# Altium schematic sheet MCED_IO.SchDoc
size A4; SheetNumber: 2; SheetTotal: 2
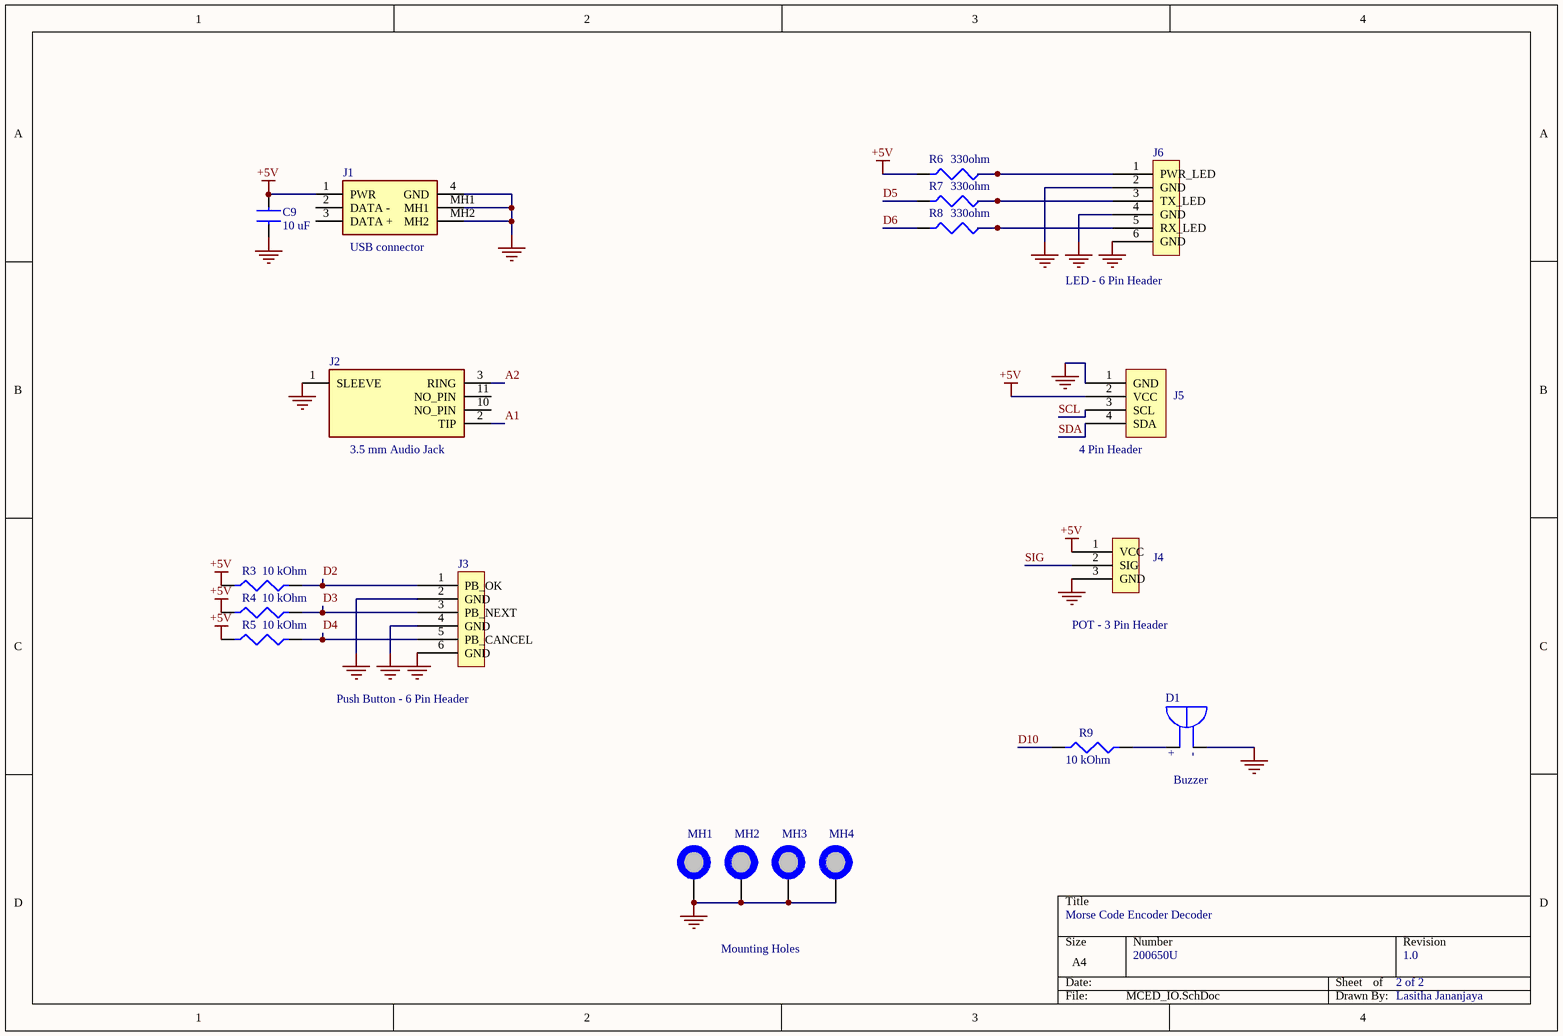
[diagram p0: MCED_IO.SchDoc]

## Parts
C9  10 uF  [C0805]
D1  Buzzer  [Buzzer]
J1  USB connector  [USB 2.0 type B 617291011BLF]
J2  3.5 mm Audio Jack  [Audio Jack SJ13523N]
J3  Push Button - 6 Pin Header  [6 PIN HEADER]
J4  POT - 3 Pin Header  [3 PIN HEADER]
J5  4 Pin Header  [4 Pin Header]
J6  LED - 6 Pin Header  [6 PIN HEADER]
MH1  MH  [Mounting Hole]  (value not drawn)  (no BOM)
MH2  MH  [Mounting Hole]  (value not drawn)  (no BOM)
MH3  MH  [Mounting Hole]  (value not drawn)  (no BOM)
MH4  MH  [Mounting Hole]  (value not drawn)  (no BOM)
R3  10 kOhm  [10K]
R4  10 kOhm  [10K]
R5  10 kOhm  [10K]
R6  330ohm  [300Ohm RESC2012X60N]
R7  330ohm  [300Ohm RESC2012X60N]
R8  330ohm  [300Ohm RESC2012X60N]
R9  10 kOhm  [10K]

## Nets
+5V: C9.2 J1.1(PWR) J4.1(VCC) J5.2(VCC) R3.2 R4.2 R5.2 R6.1
GND: C9.1 D1.N(NEG) J1.4(GND) J1.MH1 J1.MH2 J2.1(SLEEVE) J3.2(GND) J3.4(GND) J3.6(GND) J4.3(GND) J5.1(GND) J6.2(GND) J6.4(GND) J6.6(GND) MH1.1 MH2.1 MH3.1 MH4.1
A1: J2.2(TIP)
A2: J2.3(RING)
D2: J3.1(PB_OK) R3.1
D3: J3.3(PB_NEXT) R4.1
D4: J3.5(PB_CANCEL) R5.1
D5: R7.1
D6: R8.1
D10: R9.2
SCL: J5.3(SCL)
SDA: J5.4(SDA)
SIG: J4.2(SIG)
NetD1_P: D1.P(POS) R9.1
NetJ6_1: J6.1(PWR_LED) R6.2
NetJ6_3: J6.3(TX_LED) R7.2
NetJ6_5: J6.5(RX_LED) R8.2

Not connected (* = marked no-connect by the designer): J1 2(DATA_-) 3(DATA_+); J2 10(NO_PIN) 11(NO_PIN)

## Notes on the sheet
- Morse Code Encoder Decoder
- Mounting Holes
- 200650U
- 2 of 2
- 1.0
- Lasitha Jananjaya
- (in symbol KXG1201C) +; -

## Library data of the parts
C9 = CL21A106KBYQNNE: 10 uF Ceramic Capacitor, Multilayer, Ceramic, 50V, 10% +Tol, 10% -Tol, X5R, 15% TC, 10uF, Surface Mount, 0805; Manufacturer: Samsung; Supplier: Mouser; Supplier Part Number: 187-CL21A106KBYQNNE; Manufacturer Part Number: CL21A106KBYQNNE; RoHS: Yes; Category: Ceramic Capacitors; Stock: 29602; Pricing: 1=0.42, 10=0.299, 50=0.299, 100=0.197, 1000=0.124, 10000=0.1 (USD); Pins: 2; Dielectric Material: Ceramic; Capacitor Type: Ceramic; Reach SVHC Compliant: Yes; RoHS Compliant: Yes; ComponentLink1URL: https://datasheet.ciiva.com:443/pdfs/VipMasterIC/IC/SEMS/SEMS-S-A0008524728/SEMS-S-A0008519922-1.pdf?src-supplier=IHS+Markit; ComponentLink1Description: https://datasheet.ciiva.com:443/pdfs/VipMasterIC/IC/SEMS/SEMS-S-A0008524728/SEMS-S-A0008519922-1.pdf?src-supplier=IHS+Markit
D1 = KXG1201C: Buzzer - Magnetic Indicator Active Buzzer [Kingstate], Pine Type, Dimensions(mm): 12.00*9.50, Voltage:1.2~3.0, Max current consumption(mA): Max. 30, SPL(dB): Min. 80dB(Typical 85)@10cm, Frequency(KHz): 2.30.; Package: None; MF: Kingstate; Value: *; Availability: In Stock; SnapEDA_Link: https://www.snapeda.com/parts/KXG1201C/Kingstate/view-part/?ref=snap; MP: KXG1201C; Price: None; Check_prices: https://www.snapeda.com/parts/KXG1201C/Kingstate/view-part/?ref=eda
J1 = 61729-1011BLF: USB 2.0 connector, Type B, Receptacle, Through Hole, 30u GXT Contact, 4 Pins, 1.57mm PCB; Manufacturer: Amphenol ICC / FCI; Supplier: Avnet; Supplier Part Number: 61729-1011BLF; Manufacturer Part Number: 61729-1011BLF; RoHS: No; Category: Connectors; ComponentLink1URL: https://datasheet.ciiva.com/8015/697864-8015261.pdf?src-supplier=Element14; ComponentLink1Description: https://datasheet.ciiva.com/8015/697864-8015261.pdf?src-supplier=Element14
J2 = SJ1-3523N: 3.5 mm Audio Jack, Female, 3 Pole(s), Solder Terminal, Jack; Manufacturer: CUI Devices; Supplier: Mouser; Supplier Part Number: 490-SJ1-3523N; Manufacturer Part Number: SJ1-3523N; RoHS: Yes; Category: Audio / Video Connectors; Stock: 9497; Pricing: 1=1.08, 10=0.913, 50=0.913, 100=0.819, 1000=0.596, 10000=0.495 (USD); Reach SVHC Compliant: Yes
J3 J6 = 929850-01-06-RB: 6 Pin Header Board Connector; Manufacturer: 3M; Manufacturer Series: 929; Supplier: Mouser; Supplier Part Number: 517-929850-01-06-RB; Manufacturer Part Number: 929850-01-06-RB; RoHS: Yes; Category: Headers and Wire Housings; Stock: 258; Pricing: 1=2.56, 10=2.08, 50=2.08, 100=1.99, 1000=1.42, 10000=1.26 (USD); Connector Type: BOARD CONNECTOR; Reach SVHC Compliant: Yes; RoHS Compliant: Yes; ComponentLink1URL: https://datasheet.ciiva.com:443/pdfs/VipMasterIC/IC/IIIM/IIIMS03618/IIIMS03618-1.pdf?src-supplier=IHS+Markit; ComponentLink1Description: https://datasheet.ciiva.com:443/pdfs/VipMasterIC/IC/IIIM/IIIMS03618/IIIMS03618-1.pdf?src-supplier=IHS+Markit; ComponentLink2URL: https://datasheet.ciiva.com/5148/ts0815-5148223.pdf?src-supplier=Mouser; ComponentLink2Description: https://datasheet.ciiva.com/5148/ts0815-5148223.pdf?src-supplier=Mouser; ComponentLink3URL: https://datasheet.ciiva.com/756/ts0815-756418.pdf?src-supplier=Digi-Key; ComponentLink3Description: https://datasheet.ciiva.com/756/ts0815-756418.pdf?src-supplier=Digi-Key
J4 = 929850-01-03-RA: 3 Pin Header Board Connector, 3 Contact(s), 1 Row(s), Female, Straight, Solder Terminal, Socket; Manufacturer: 3M; Manufacturer Series: 929; Option: General Purpose; Filter Feature: No; Number of Rows Loaded: 1; Number of Contacts: 3; Supplier: Digi-Key; Supplier Part Number: 19-929850-01-03-RA-ND; Manufacturer Part Number: 929850-01-03-RA; RoHS: Yes; Category: Headers and Wire Housings; Stock: 1296; Pricing: 1=1.97, 10=1.719, 100=1.536, 500=1.28002, 1000=1.09716, 5000=0.97282, 10000=0.95088 (USD); Mounting Technology: Board; Contact Material: Copper Alloy; Contact Finish - Mating: GOLD (10) OVER NICKEL (100); Contact Finish - Termination: MATTE TIN OVER NICKEL (100); Connector Type: BOARD CONNECTOR; JESD-609 Code: e3; Additional Feature: 3M; Body/Shell Style: SOCKET; Contact Gender: Female; Mixed Contacts: No; Mounting Style: STRAIGHT; Termination: Solder; Terminal Pitch: 2.54mm; Flammability Rating: UL94 V-0; DIN Conformance: No; IEC Conformance: No; MIL Conformance: No; Reach SVHC Compliant: Yes; RoHS Compliant: Yes; ComponentLink1URL: https://datasheet.ciiva.com:443/pdfs/VipMasterIC/IC/IIIM/IIIMS03618/IIIMS03618-1.pdf?src-supplier=IHS+Markit; ComponentLink1Description: https://datasheet.ciiva.com:443/pdfs/VipMasterIC/IC/IIIM/IIIMS03618/IIIMS03618-1.pdf?src-supplier=IHS+Markit; ComponentLink2URL: https://datasheet.ciiva.com/746/ts0815-746343.pdf?src-supplier=Digi-Key; ComponentLink2Description: https://datasheet.ciiva.com/746/ts0815-746343.pdf?src-supplier=Digi-Key; ComponentLink3URL: https://datasheet.ciiva.com/5167/ts0815-5167287.pdf?src-supplier=Mouser; ComponentLink3Description: https://datasheet.ciiva.com/5167/ts0815-5167287.pdf?src-supplier=Mouser
J5 = M20-7820446: 4 Pin Header Board Connector, 4 Contact(s), 1 Row(s), Female, Straight, 0.1 inch Pitch, Solder Terminal, Locking, Black Insulator, Socket; Manufacturer: Harwin; Option: General Purpose; Contact Pattern: RECTANGULAR; Contact Resistance: 20mR; Contact Style: SQ PIN-SKT; Dielectric Withstanding Voltage (AC): 1kV; Durability: 300Cycles; Filter Feature: No; Insulation Resistance: 1GR; Number Of Connectors: 1; Polarization Key: POLARIZED HOUSING; Rated Current (Signal): 3A; Number of Contacts: 4; Body Breadth: 0.098inch; Body Depth: 0.335inch; Body Length: 0.4inch; Reference Standard: UL; Reliability: COMMERCIAL; Supplier: Digi-Key; Supplier Part Number: 952-1792-ND; Manufacturer Part Number: M20-7820446; RoHS: Yes; Category: Headers and Wire Housings; Stock: 3461; Pricing: 1=1.02, 10=0.859, 100=0.771, 500=0.63084, 1000=0.56075, 5000=0.49066, 10000=0.46613 (USD); Mounting Technology: Board; Contact Finish - Mating: TIN; Contact Finish - Termination: TIN; Insulation Color: Black; Insulation Material: Polyamide; Min Operating Temperature: -40°C; Max Operating Temperature: 105°C; Connector Type: BOARD CONNECTOR; JESD-609 Code: e3; Body/Shell Style: SOCKET; Contact Gender: Female; Mixed Contacts: No; Mounting Style: STRAIGHT; Number Of PCB Rows: 1; Number of Rows Loaded: 1; PCB Contact Pattern: RECTANGULAR; Termination: Solder; Mating Contact Pitch: 0.1inch; Mounting Option 1: LOCKING; Terminal Length: 0.118inch; Terminal Pitch: 2.54mm; Flammability Rating: UL94 V-0; DIN Conformance: No; IEC Conformance: No; MIL Conformance: No; Reach SVHC Compliant: Yes; RoHS Compliant: Yes; ComponentLink1URL: https://datasheet.ciiva.com:443/pdfs/VipMasterIC/IC/HRWN/HRWN-S-A0004894635/HRWN-S-A0004894635-1.pdf?src-supplier=IHS+Markit; ComponentLink1Description: https://datasheet.ciiva.com:443/pdfs/VipMasterIC/IC/HRWN/HRWN-S-A0004894635/HRWN-S-A0004894635-1.pdf?src-supplier=IHS+Markit; ComponentLink2URL: https://datasheet.ciiva.com/11747/0900766b80dc1d2b-11747084.pdf?src-supplier=Rs; ComponentLink2Description: https://datasheet.ciiva.com/11747/0900766b80dc1d2b-11747084.pdf?src-supplier=Rs; ComponentLink3URL: https://datasheet.ciiva.com/6784/m20-782-6784360.pdf?src-supplier=Digi-Key; ComponentLink3Description: https://datasheet.ciiva.com/6784/m20-782-6784360.pdf?src-supplier=Digi-Key; ComponentLink4URL: https://datasheet.ciiva.com/7639/1836950-7639727.pdf?src-supplier=Element14; ComponentLink4Description: https://datasheet.ciiva.com/7639/1836950-7639727.pdf?src-supplier=Element14; ComponentLink5URL: https://datasheet.ciiva.com/10151/m20-782-10151359.pdf?src-supplier=Avnet; ComponentLink5Description: https://datasheet.ciiva.com/10151/m20-782-10151359.pdf?src-supplier=Avnet
MH1-MH4 = Mounting Hole
R3-R5 R9 = MCU0805MD1002DP500: 10 kOhm, Fixed Resistor, Thin Film, 0.2W, 10000ohm, 150V, 0.5% +/-Tol, -25,25ppm/Cel, 0805; Manufacturer: Vishay Beyschlag; Power: 200mW; Value: 10kR; Temperature Coefficient: -2525ppm/°C; Package Height: 0.52mm; Package Length: 2mm; Package Width: 1.25mm; Reference Standard: AEC-Q200; Supplier: Mouser; Supplier Part Number: 594-MCU0805MD1002DP5; Manufacturer Part Number: MCU0805MD1002DP500; RoHS: Yes; Category: Chip SMD Resistors; Stock: 49020; Pricing: 1=0.39, 10=0.3, 50=0.3, 100=0.127, 1000=0.07, 10000=0.06 (USD); Pins: 2; Case/Package: 0805; Terminal Finish: Nickel; Min Operating Temperature: -55°C; Max Operating Temperature: 175°C; Tolerance: 0.5%; JESD-609 Code: e3; Resistor Type: FIXED RESISTOR; Construction: Chip; Package Style: SMTMeter; Packaging: Tape and Reel; Series: MCU 0805 AT-PROF; Technology: THIN FILM; Working Voltage: 150V; Reach SVHC Compliant: Yes; RoHS Compliant: Yes; ComponentLink1URL: https://datasheet.ciiva.com:443/pdfs/VipMasterIC/IC/VISH/VISH-S-A0002932058/VISH-S-A0002932058-1.pdf?src-supplier=IHS+Markit; ComponentLink1Description: https://datasheet.ciiva.com:443/pdfs/VipMasterIC/IC/VISH/VISH-S-A0002932058/VISH-S-A0002932058-1.pdf?src-supplier=IHS+Markit; ComponentLink2URL: https://datasheet.ciiva.com/12696/mcat-pro-223602-12696124.pdf?src-supplier=Mouser; ComponentLink2Description: https://datasheet.ciiva.com/12696/mcat-pro-223602-12696124.pdf?src-supplier=Mouser
R6-R8 = CRCW0805330RFKEA: 330ohm, Fixed Resistor, Metal Glaze/thick Film, 0.125W, 150V, 1% +/-Tol, 100ppm/Cel, Surface Mount, 0805; Manufacturer: Vishay; Power: 125mW; Value: 330R; Temperature Coefficient: 100ppm/°C; Rated Temperature: 70°C; Package Height: 0.45mm; Package Length: 2mm; Package Width: 1.25mm; Reference Standard: AEC-Q200; Supplier: Mouser; Supplier Part Number: 71-CRCW0805-330-E3; Manufacturer Part Number: CRCW0805330RFKEA; RoHS: Yes; Category: Chip SMD Resistors; Stock: 46; Pricing: 1=0.13, 10=0.068, 50=0.068, 100=0.028, 1000=0.013, 10000=0.008 (USD); Mounting Technology: Surface Mount; Pins: 2; Case/Package: 0805; Terminal Finish: Nickel; Package Shape: Rectangular; Min Operating Temperature: -55°C; Max Operating Temperature: 155°C; Tolerance: 1%; JESD-609 Code: e3; Resistor Type: FIXED RESISTOR; Construction: Chip; Package Style: SMTMeter; Packaging: Tape and Reel; Technology: METAL GLAZE/THICK FILM; Working Voltage: 150V; Termination: Wraparound; Reach SVHC Compliant: Yes; RoHS Compliant: Yes; ComponentLink1URL: https://datasheet.ciiva.com:443/pdfs/VipMasterIC/IC/VISH/VISH-S-A0007266705/VISH-S-A0007266705-1.pdf?src-supplier=IHS+Markit; ComponentLink1Description: https://datasheet.ciiva.com:443/pdfs/VipMasterIC/IC/VISH/VISH-S-A0007266705/VISH-S-A0007266705-1.pdf?src-supplier=IHS+Markit; ComponentLink2URL: https://datasheet.ciiva.com/7777/1720486-7777573.pdf?src-supplier=Element14; ComponentLink2Description: https://datasheet.ciiva.com/7777/1720486-7777573.pdf?src-supplier=Element14; ComponentLink3URL: https://datasheet.ciiva.com/8944/dcrcwe3-8944773.pdf?src-supplier=Avnet; ComponentLink3Description: https://datasheet.ciiva.com/8944/dcrcwe3-8944773.pdf?src-supplier=Avnet; ComponentLink4URL: https://datasheet.ciiva.com/8944/dcrcwe3-8944776.pdf?src-supplier=Avnet; ComponentLink4Description: https://datasheet.ciiva.com/8944/dcrcwe3-8944776.pdf?src-supplier=Avnet; ComponentLink5URL: https://datasheet.ciiva.com/2495/dcrcwe3-2495804.pdf?src-supplier=Digi-Key; ComponentLink5Description: https://datasheet.ciiva.com/2495/dcrcwe3-2495804.pdf?src-supplier=Digi-Key; ComponentLink6URL: https://datasheet.ciiva.com/5545/dcrcwe3-109170-5545357.pdf?src-supplier=Mouser; ComponentLink6Description: https://datasheet.ciiva.com/5545/dcrcwe3-109170-5545357.pdf?src-supplier=Mouser; ComponentLink7URL: https://datasheet.ciiva.com/7777/1697337-7777390.pdf?src-supplier=Element14; ComponentLink7Description: https://datasheet.ciiva.com/7777/1697337-7777390.pdf?src-supplier=Element14; ComponentLink8URL: https://datasheet.ciiva.com/2495/dcrcwe3-2495805.pdf?src-supplier=Digi-Key; ComponentLink8Description: https://datasheet.ciiva.com/2495/dcrcwe3-2495805.pdf?src-supplier=Digi-Key; ComponentLink9URL: https://datasheet.ciiva.com/2495/dcrcwe3-2495803.pdf?src-supplier=Digi-Key; ComponentLink9Description: https://datasheet.ciiva.com/2495/dcrcwe3-2495803.pdf?src-supplier=Digi-Key; ComponentLink10URL: https://datasheet.ciiva.com/16769/70201119-16769852.pdf?src-supplier=Allied+Electronics; ComponentLink10Description: https://datasheet.ciiva.com/16769/70201119-16769852.pdf?src-supplier=Allied+Electronics